# EAGLE design Outside Pool Controller v2 (EAGLE 6.5.0)
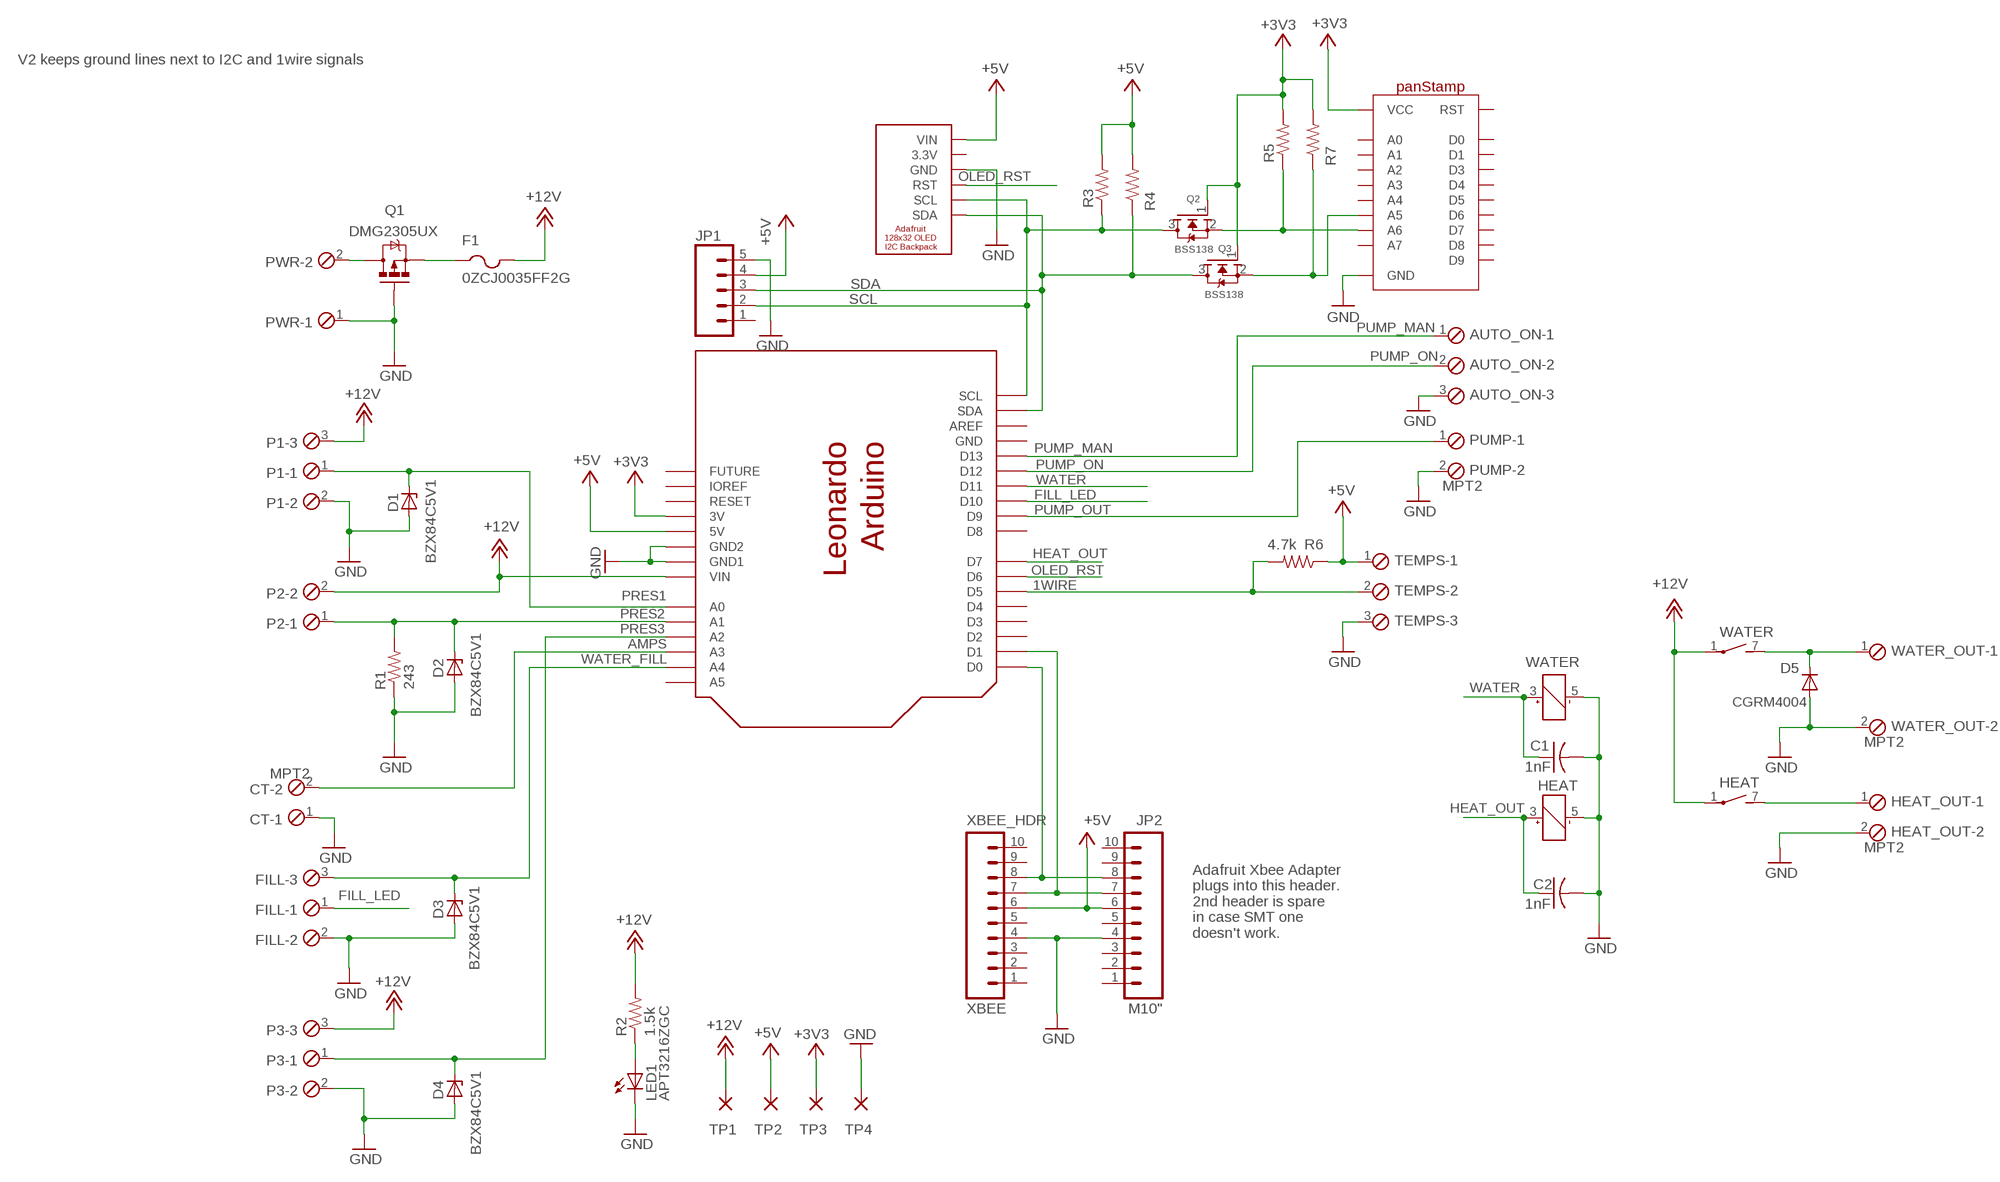
[diagram p0: schematic, sheet 1]

## Parts
AUTO_ON  MPT3  [3POL254]
C1  1nF  C-USC1206  [C1206]
C2  1nF  C-USC1206  [C1206]
CT  MPT2  [2POL254]
D1  BZX84C5V1  ZENER-DIODESOT23  [SOT23]
D2  BZX84C5V1  ZENER-DIODESOT23  [SOT23]
D3  BZX84C5V1  ZENER-DIODESOT23  [SOT23]
D4  BZX84C5V1  ZENER-DIODESOT23  [SOT23]
D5  CGRM4004  DIODE_SOD-123FL  [SOD-123FL]
F1  0ZCJ0035FF2G  PTCFUSE-1206  [R1206]
FILL  MPT3  [3POL254]
HEAT  REED  [REED]
HEAT_OUT  MPT2  [2POL254]
JP1  M05NO_SILK  [1X05_NO_SILK]
JP2  M10"  [1X10]
LED1  APT3216ZGC  LEDCHIPLED_1206  [CHIPLED_1206]
P1  MPT3  [3POL254]
P2  MPT2  [2POL254]
P3  MPT3  [3POL254]
PUMP  MPT2  [2POL254]
PWR  MPT2  [2POL254]
Q1  DMG2305UX  MOSFET-PCHANNELSMD  [SOT23-3]
Q2  BSS138  MOSFET-NREFLOW  [SOT23]
Q3  BSS138  MOSFET-NREFLOW  [SOT23]
R1  243  R-US_M1206  [M1206]
R2  1.5k  R-US_M1206  [M1206]
R3  R-US_M1206  [M1206]
R4  R-US_M1206  [M1206]
R5  R-US_M1206  [M1206]
R6  4.7k  R-US_M1206  [M1206]
R7  R-US_M1206  [M1206]
TEMPS  MPT3  [3POL254]
TP1  2,15/1,0  [2,15/1,0]
TP2  2,15/1,0  [2,15/1,0]
TP3  WIREPAD2,15/1,0  [2,15/1,0]
TP4  WIREPAD2,15/1,0  [2,15/1,0]
U$1  ARDUINO_LEONARDO  [ARDUINO_LEONARDO]
U$2  ADAFRUIT_128X32_OLED  [ADAFRUIT_OLED_128X32]
U$3  PANSTAMPNO_TEXT  [PANSTAMP_NOTEXT]
WATER  REED  [REED]
WATER_OUT  MPT2  [2POL254]
XBEE_HDR  XBEE  M10SMD_MALE  [1X10_SMD_MALE]

## Nets
1WIRE: R6.2 TEMPS.2 U$1.D5
+3V3 [power]: Q2.1(G) Q3.1(G) R5.2 R7.2 TP3.1(P) U$1.3V U$3.VCC
+5V [power]: JP1.4 JP2.6 R3.2 R4.2 R6.1 TEMPS.1 TP2.1(P) U$1.5V U$2.P$6(VIN) XBEE_HDR.6
+12V [power]: F1.2 HEAT.1(2:P) P1.3 P2.2 P3.3 R2.2 TP1.1(P) U$1.VIN WATER.1(2:P)
AMPS: CT.2 U$1.A3
FILL_LED: FILL.1 U$1.D10
GND [power]: AUTO_ON.3 C1.2 C2.2 CT.1 D1.1(A) D2.1(A) D3.1(A) D4.1(A) D5.A FILL.2 HEAT.5(1:-) HEAT_OUT.2 JP1.5 JP2.4 LED1.C P1.2 P3.2 PUMP.2 PWR.1 Q1.1(G) R1.1 TEMPS.3 TP4.1(P) U$1.GND$2(GND2) U$1.GND$3(GND1) U$2.P$4(GND) U$3.GND$1(GND) U$3.GND$7(GND) U$3.GND$15(GND) U$3.GND$23(GND) U$3.GND$24(GND) WATER.5(1:-) WATER_OUT.2 XBEE_HDR.4
HEAT_OUT: C2.1 HEAT.3(1:+) U$1.D7
N$1: D5.C WATER.7(2:S) WATER_OUT.1
N$2: HEAT.7(2:S) HEAT_OUT.1
N$3 [power]: PWR.2 Q1.3(D)
N$4: LED1.A R2.1
N$5 [power]: F1.1 Q1.2(S)
OLED_RST: U$1.D6 U$2.P$3(RST)
PRES1: D1.3(C) P1.1 U$1.A0
PRES2: D2.3(C) P2.1 R1.2 U$1.A1
PRES3: D4.3(C) P3.1 U$1.A2
PUMP_MAN: AUTO_ON.1 U$1.D13
PUMP_ON: AUTO_ON.2 U$1.D12
PUMP_OUT: PUMP.1 U$1.D9
SCL: JP1.2 Q2.3(D) R3.1 U$1.SCL U$2.P$2(SCL)
SCL3.3: Q2.2(S) R5.1 U$3.A6
SDA: JP1.3 Q3.3(D) R4.1 U$1.SDA U$2.P$1(SDA)
SDA3.3: Q3.2(S) R7.1 U$3.A5
WATER: C1.1 U$1.D11 WATER.3(1:+)
WATER_FILL: D3.3(C) FILL.3 U$1.A4
XBEE0: JP2.8 U$1.D0 XBEE_HDR.8
XBEE1: JP2.7 U$1.D1 XBEE_HDR.7
Unconnected: JP1.1 JP2.1 JP2.2 JP2.3 JP2.5 JP2.9 JP2.10 U$1.A5 U$1.AREF U$1.D2 U$1.D3 U$1.D4 U$1.D8 U$1.IOREF U$1.RESERVED(FUTURE) U$1.RESET U$3.A0 U$3.A1 U$3.A2 U$3.A3 U$3.A4 U$3.A7 U$3.D0 U$3.D1 U$3.D3 U$3.D4 U$3.D5 U$3.D6 U$3.D7 U$3.D8 U$3.D9 U$3.RESET(RST) XBEE_HDR.1 XBEE_HDR.2 XBEE_HDR.3 XBEE_HDR.5 XBEE_HDR.9 XBEE_HDR.10

## Notes on the sheet
- V2 keeps ground lines next to I2C and 1wire signals
- Adafruit Xbee Adapter
  plugs into this header.
  2nd header is spare 
  in case SMT one
  doesn't work.

## Power pins joined to a net without a drawn wire
3.3V: U$2.P$5(3.3V)
GND: U$1.GND

## Library data of the parts
AUTO_ON FILL P1 P3 TEMPS = con-phoenix-254:MPT3: Screw Terminal Block 0.1" pitch Pheonix 1725669 TE 282834-3; OC_FARNELL: unknown; OC_NEWARK: unknown
C1 C2 = rcl:C-US: CAPACITOR, American symbol
CT HEAT_OUT P2 PUMP PWR WATER_OUT = con-phoenix-254:MPT2: Screw Terminal Block 0.1" pitch Pheonix 1725656 TE 282834-2; OC_FARNELL: unknown; OC_NEWARK: unknown
D1-D4 = diode:ZENER-DIODE: Z-Diode
D5 = adafruit:DIODE: Diode SMADIODE - SMA Surface Mount Package 20V 1A Schottky Diode Digikey: 641-1014-6-ND DO-1N4148 - Through Hole Small Current Diode SOD-123 20V 1 A (.5mV Vf) Schottky Diode - Digikey: MBRX120TPMSCT-ND SOD-323 10V 570mA (.38mV Vf, 3ns) Schottky Diode - Digikey: ZLLS410CT-ND SOD-523 30V 30mA Schottky Diode (RB751S-40TE61) - Digikey: RB751S-40TE61CT-ND SOT23-R/W - SOT23 Package (R = Solder Paste/Reflow Ovens, W = Hand-Soldering) BAT54Film 40V 300mA - Digikey: 497-7162-1-ND
F1 = adafruit:PTCFUSE: PTC fuses, resettable thermistors
HEAT WATER = relay:REED: RELAY reed, 1 x norm. open with polarity, grid 5.08; OC_FARNELL: unknown; OC_NEWARK: unknown
JP1 = SparkFun-Connectors:M05: Header 5 Standard 5-pin 0.1" header. Use with straight break away headers (SKU : PRT-00116), right angle break away headers (PRT-00553), swiss pins (PRT-00743), machine pins (PRT-00117), and female headers (PRT-00115). Molex polarized connector foot print use with SKU : PRT-08230 with associated crimp pins and housings.
JP2 = SparkFun-Connectors:M10: Header 10 Standard 10-pin 0.1" header. Use with straight break away headers (SKU : PRT-00116), right angle break away headers (PRT-00553), swiss pins (PRT-00743), machine pins (PRT-00117), and female headers (PRT-00115).
LED1 = adafruit:LED: LED OSRAM: - CHIPLED LG R971, LG N971, LY N971, LG Q971, LY Q971, LO R971, LY R971 LH N974, LH R974 LS Q976, LO Q976, LY Q976 LO Q996 - Hyper CHIPLED LW Q18S LB Q993, LB Q99A, LB R99A - SideLED LS A670, LO A670, LY A670, LG A670, LP A670 LB A673, LV A673, LT A673, LW A673 LH A674 LY A675 LS A676, LA A676, LO A676, LY A676, LW A676 LS A679, LY A679, LG A679 - Hyper Micro SIDELED® LS Y876, LA Y876, LO Y876, LY Y876 LT Y87S - SmartLED LW L88C, LW L88S LB L89C, LB L89S, LG L890 LS L89K, LO L89K, LY L89K LS L896, LA L896, LO L896, LY L896 - TOPLED LS T670, LO T670, LY T670, LG T670, LP T670 LSG T670, LSP T670, LSY T670, LOP T670, LYG T670 LG T671, LOG T671, LSG T671 LB T673, LV T673, LT T673, LW T673 LH T674 LS T676, LA T676, LO T676, LY T676, LB T676, LH T676, LSB T676, LW T676 LB T67C, LV T67C, LT T67C, LS T67K, LO T67K, LY T67K, LW E67C LS E67B, LA E67B, LO E67B, LY E67B, LB E67C, LV E67C, LT E67C LW T67C LS T679, LY T679, LG T679 LS T770, LO T770, LY T770, LG T770, LP T770 LB T773, LV T773, LT T773, LW T773 LH T774 LS E675, LA E675, LY E675, LS T675 LS T776, LA T776, LO T776, LY T776, LB T776 LHGB T686 LT T68C, LB T68C - Hyper Mini TOPLED® LB M676 - Mini TOPLED Santana® LG M470 LS M47K, LO M47K, LY M47K Source: http://www.osram.convergy.de/
Q1 = SparkFun-DiscreteSemi:MOSFET-PCHANNEL: Generic PMOSFET IRLML2244 - TRANS-11153 (SOT-23 -20V -4.3A) (1.Gate 2.Source 3.Drain) FQP27P06 - COM-10349 <http://www.sparkfun.com/products/10349> (TO-220 -60V -27A) (1.Gate 2.Source 3.Drain)
Q2 Q3 = adafruit:MOSFET-N: N-Channel Mosfet 2N7002E - 60V 260mA SOT23 [Digikey: 2N7002ET1GOSTR-ND] - REEL BSH103 - 30V 850mA SOT23 [Digikey: 568-5013-1-ND]
R1-R7 = adafruit:R-US_: RESISTOR, American symbol
TP1 TP2 = wirepad:2,15/1,0: THROUGH-HOLE PAD
TP3 TP4 = wirepad:WIREPAD: Wire PAD connect wire on PCB
U$1 = SRG:ARDUINO_LEONARDO: Arduino Leonardo I2C Pins: D2, D3 PWM Pins: D3, D5, D5, D11, D13 Interrup Pint: D2, D3 http://arduino.cc/en/Main/arduinoBoardLeonardo
U$2 = SRG:ADAFRUIT_128X32_OLED: Adafriut 128x32 OLED display with I2C communication http://www.adafruit.com/products/931
U$3 = SRG:PANSTAMP: panStamp panStamps are small wireless modules programmable from the Arduino IDE. Each module contains an Atmega328p MCU and a Texas Instruments CC1101 RF interface, providing the necessary connectivity and processing power to create autonomous low-power wireless motes. Everything contained into a compact DIP-24 module. http://www.panstamp.com Vin: 2.5 to 3.6 volts A4 - SDA A5 - SCL PWM: D3,5,6,9,10,11 Interrupts: D2,3 Connected grounds with command: CONNECT ANY GND 'GND$1 GND$7 GND$15 GND$23 GND$24';
XBEE_HDR = SparkFun-Connectors:M10: Header 10 Standard 10-pin 0.1" header. Use with straight break away headers (SKU : PRT-00116), right angle break away headers (PRT-00553), swiss pins (PRT-00743), machine pins (PRT-00117), and female headers (PRT-00115).; PROD_ID: CONN-11291

## Net classes
0 default: width 0.254 mm, drill 0.254 mm, clearance 0.254 mm
1 power: width 0.406 mm, drill 0.254 mm, clearance 0.254 mm

## Board
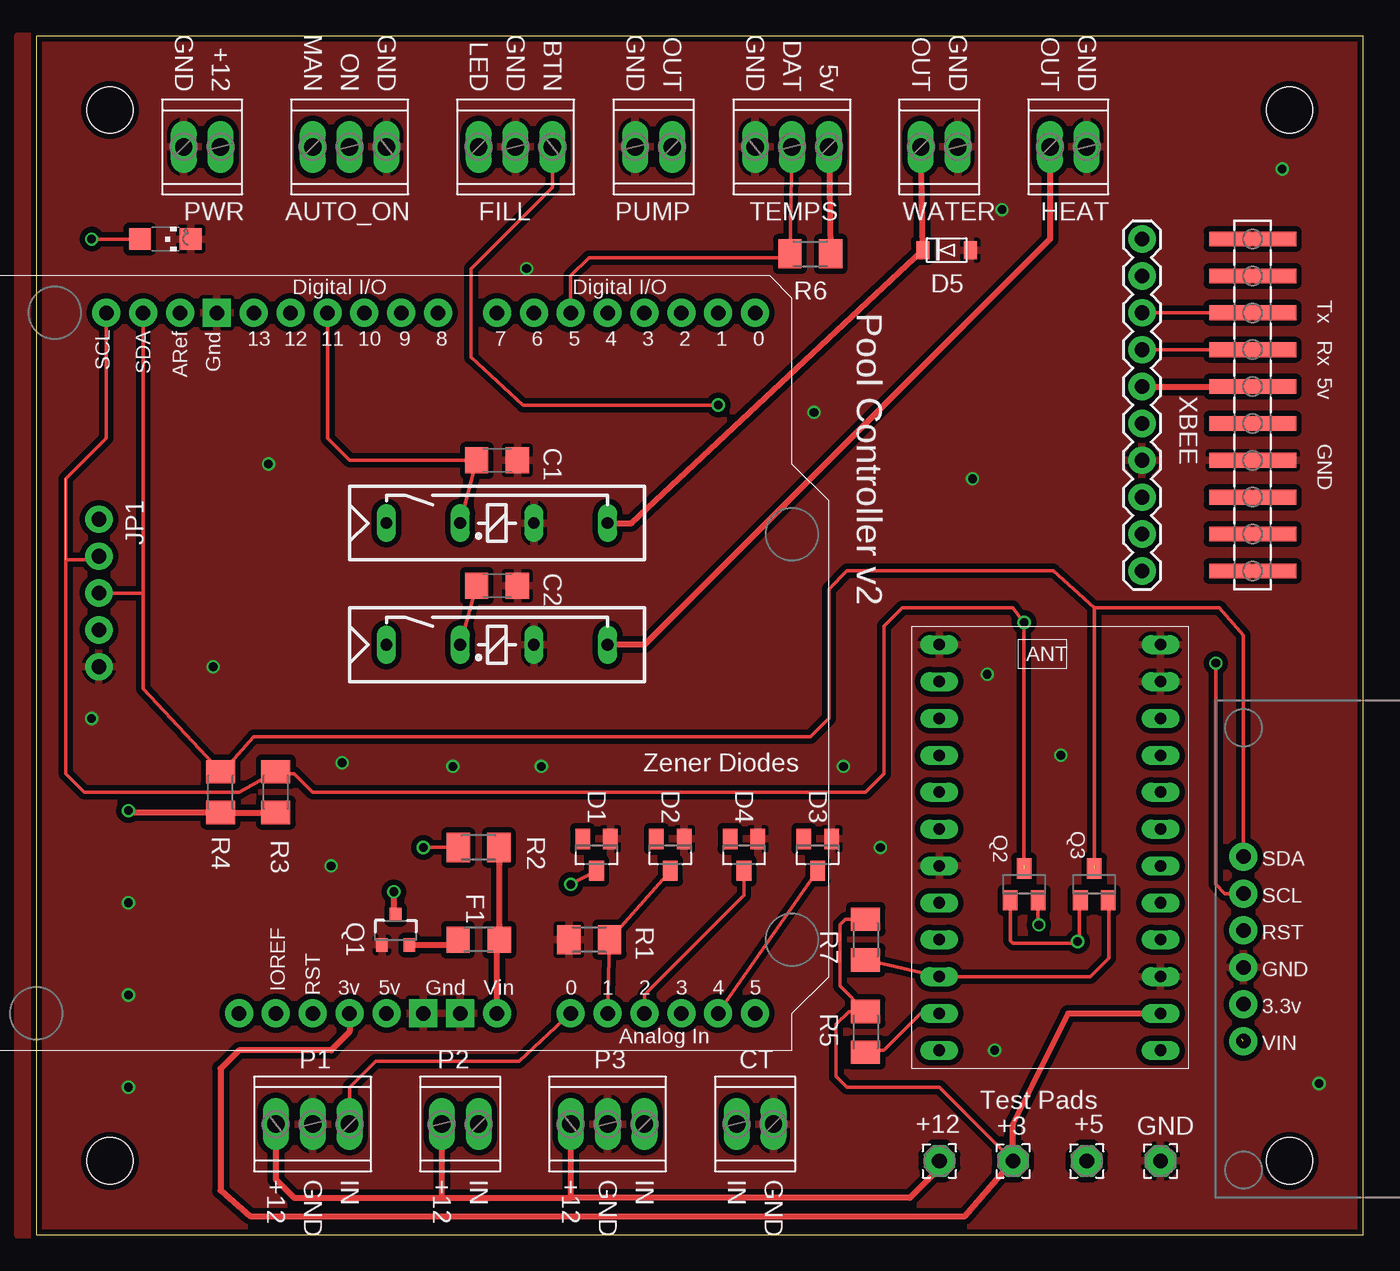
[diagram p1: board, top side]
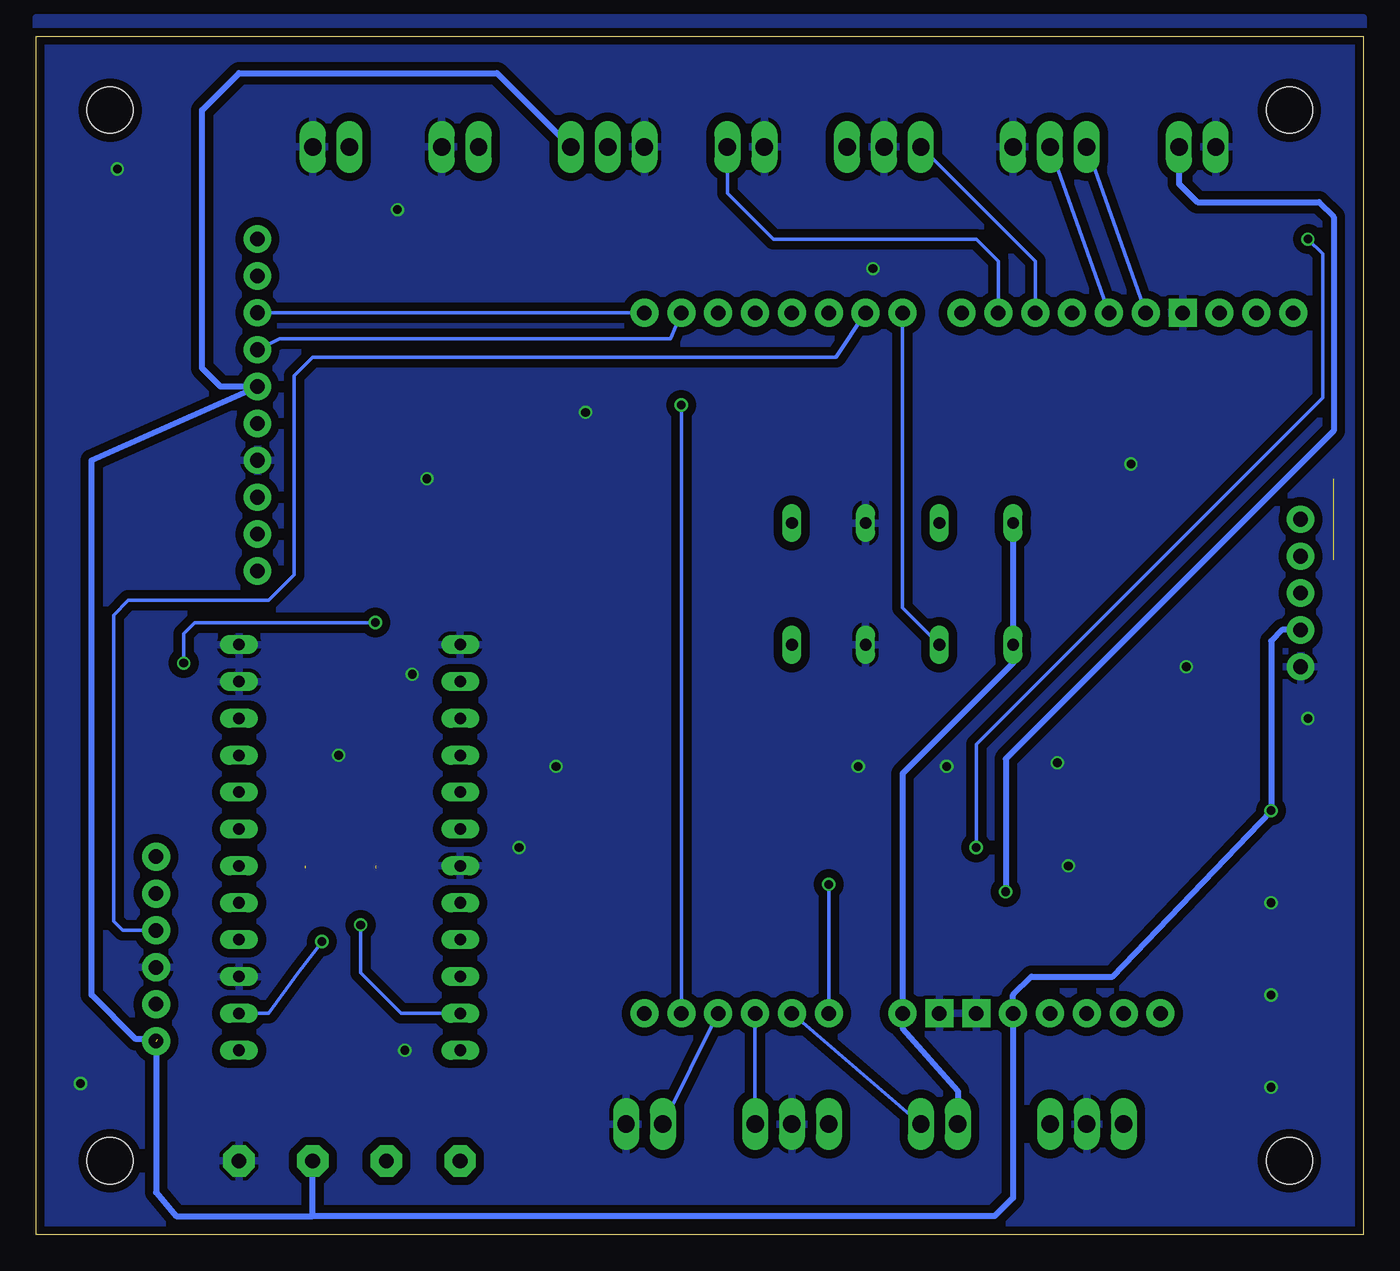
[diagram p2: board, bottom side, seen from below]

Size 91.44 x 82.55 mm. Coordinates in mm from the lower left corner, seen from the top.
Outline: 91.44,0 91.44,82.55 0,82.55 0,0 91.44,0
Copper layers (1*16): Top 0.035mm / dielectric 1.5mm / Bottom 0.035mm
Design rules "ITEADstudio_DRC": minimum track width 6mil, minimum drill 12mil, track to track 6mil, track to pad 6mil, pad to pad 6mil, via to via 6mil, smd to smd 0mil, copper to edge 10mil, drill to drill 10mil, minimum pad ring 10mil, minimum via ring 6mil, stop-mask expansion 2mil, vias tented up to drill 100mil, thermal gap 10mil
Holes 3.2 mm at 5.08,77.47 86.36,77.47 86.36,5.08 5.08,5.08

### Footprints (pad centres in the part's own frame; a part is rotated, then mirrored left to right if it is on the bottom)
3POL254 = drill 1.2 long: 1 -2.54,0; 2 0,0; 3 2.54,0
C1206 = smd 1.6 x 1.8: 1 -1.4,0; 2 1.4,0
2POL254 = drill 1.2 long: 1 -1.27,0; 2 1.27,0
SOT23 = smd 1 x 1.4: 1 -0.95,-1.1; 2 0.95,-1.1; 3 0,1.1
SOD-123FL = smd 0.91 x 1.22: A 1.637,0; C -1.637,0
R1206 = smd 1.6 x 1.803: 1 -1.422,0; 2 1.422,0
REED = drill 0.813 long: 1 -17.78,2.54; 3 -12.7,2.54; 5 -7.62,2.54; 7 -2.54,2.54
1X05_NO_SILK = drill 1.016 pad 1.88: 1 0,0; 2 2.54,0; 3 5.08,0; 4 7.62,0; 5 10.16,0
1X10 = drill 1.016 pad 1.88: 1 0,0; 2 2.54,0; 3 5.08,0; 4 7.62,0; 5 10.16,0; 6 12.7,0; 7 15.24,0; 8 17.78,0; 9 20.32,0; 10 22.86,0
CHIPLED_1206 = smd 1.5 x 1.5: A 0,-1.75; C 0,1.75
SOT23-3 = smd 0.8 x 0.9: 1 -0.95,-1; 2 0.95,-1; 3 0,1.1
M1206 = smd 1.6 x 2: 1 -1.4,0; 2 1.4,0
2,15/1,0 = drill 1.016 pad 2.159 octagon: 1 0,0
ARDUINO_LEONARDO = drill 1 pad 1.93: 3V 1.27,-24.13; 5V 3.81,-24.13; A0 16.51,-24.13; A1 19.05,-24.13; A2 21.59,-24.13; A3 24.13,-24.13; A4 26.67,-24.13; A5 29.21,-24.13; AREF -10.414,24.13; D0 29.21,24.13; D1 26.67,24.13; D2 24.13,24.13; D3 21.59,24.13; D4 19.05,24.13; D5 16.51,24.13; D6 13.97,24.13; D7 11.43,24.13; D8 7.366,24.13; D9 4.826,24.13; D10 2.286,24.13; D11 -0.254,24.13; D12 -2.794,24.13; D13 -5.334,24.13; IOREF -3.81,-24.13; RESERVED -6.35,-24.13; RESET -1.27,-24.13; SCL -15.494,24.13; SDA -12.954,24.13; VIN 11.43,-24.13 | drill 1 pad 1.93 square: GND -7.874,24.13; GND$2 8.89,-24.13; GND$3 6.35,-24.13
ADAFRUIT_OLED_128X32 = drill 1 pad 1.93: P$1 -6.985,-6.985; P$2 -4.445,-6.985; P$3 -1.905,-6.985; P$4 0.635,-6.985; P$5 3.175,-6.985; P$6 5.715,-6.985
PANSTAMP_NOTEXT = drill 0.8 long: A0 -7.62,6.35; A1 -7.62,3.81; A2 -7.62,1.27; A3 -7.62,-3.81; A4 -7.62,-6.35; A5 -7.62,-8.89; A6 -7.62,-11.43; A7 -7.62,-13.97; D0 7.62,-6.35; D1 7.62,-3.81; D3 7.62,-1.27; D4 7.62,1.27; D5 7.62,3.81; D6 7.62,6.35; D7 7.62,8.89; D8 -7.62,11.43; D9 -7.62,8.89; GND$1 -7.62,13.97; GND$7 -7.62,-1.27; GND$15 7.62,-8.89; GND$23 7.62,11.43; GND$24 7.62,13.97; RESET 7.62,-13.97; VCC 7.62,-11.43
1X10_SMD_MALE = smd 1.02 x 6: 1 0,0; 2 2.54,0; 3 5.08,0; 4 7.62,0; 5 10.16,0; 6 12.7,0; 7 15.24,0; 8 17.78,0; 9 20.32,0; 10 22.86,0

### Placement (x,y rotation side)
AUTO_ON  21.59,74.93 0 top
C1  31.75,53.34 0 top
C2  31.75,44.7 0 top
CT  49.53,7.62 180 top
D1  38.61,26.16 180 top
D2  43.69,26.16 180 top
D3  53.85,26.16 180 top
D4  48.77,26.16 180 top
D5  62.74,67.82 0 top
F1  30.48,20.32 0 top
FILL  33.02,74.93 0 top
HEAT  41.91,38.1 0 top
HEAT_OUT  71.12,74.93 0 top
JP1  4.32,49.28 270 top
JP2  76.2,45.72 90 top
LED1  8.89,68.58 270 top
P1  19.05,7.62 180 top
P2  29.21,7.62 180 top
P3  39.37,7.62 180 top
PUMP  42.55,74.93 180 top
PWR  11.43,74.93 0 top
Q1  24.77,20.95 0 top
Q2  68.07,24.13 0 top
Q3  72.9,24.13 0 top
R1  38.1,20.32 0 top
R2  30.48,26.67 0 top
R3  16.51,30.48 270 top
R4  12.7,30.48 270 top
R5  57.15,13.97 90 top
R6  53.34,67.56 180 top
R7  57.15,20.32 90 top
TEMPS  52.07,74.93 180 top
TP1  62.23,5.08 180 top
TP2  72.39,5.08 180 top
TP3  67.31,5.08 180 top
TP4  77.47,5.08 180 top
U$1  20.32,39.37 0 top
U$2  90.17,19.05 270 top
U$3  69.85,26.67 0 top
WATER  41.91,46.48 0 top
WATER_OUT  62.23,74.93 0 top
XBEE_HDR  83.82,45.72 90 top

### Tracks (layer width: path | path; a pad name or v marks a point on that pad's centre or on a via)
1WIRE
  Top 0.254: TEMPS.2 R6.2 51.69,67.31 38.1,67.31 36.83,66.04 U$1.D5
+3V3  (via drill 0.6)
  Top 0.254: R5.2 57.28,15.37 | R7.2 55.76,21.72 55.37,21.34 55.37,17.15 R5.2 | R5.2 56.01,15.37 55.12,14.48 55.12,10.92 55.88,10.16 62.23,10.16 TP3.1 | Q2.1 67.12,20.25 67.31,20.07 71.63,20.07 v71.75,20.19 71.88,20.32 71.88,22.96 Q3.1
  Top 0.406: U$1.3V 21.59,13.97 20.32,12.7 13.97,12.7 12.7,11.43 12.7,3.05 14.73,1.27 64.01,1.27 TP3.1 67.31,7.62 71.12,15.24 U$3.VCC
  Bottom 0.254: U$3.VCC 75.44,15.24 73.41,18.03 v71.75,20.19
+5V  (via drill 0.6)  (1 unrouted)
  Top 0.406: R3.2 R4.2 6.35,29.08 v6.35,29.21 | JP2.6 XBEE_HDR.6 | TEMPS.1 R6.1
  Bottom 0.406: JP1.4 5.59,41.66 6.35,40.89 v6.35,29.21 17.27,17.78 22.86,17.78 24.13,16.51 U$1.5V | 24.13,14.73 U$1.5V | U$2.P$6 83.19,2.92 81.79,1.27 72.39,1.27 | 72.39,1.27 TP2.1 | 83.06,13.46 84.58,13.46 87.63,16.51 87.63,53.34 JP2.6 78.74,58.42 80.01,59.69 80.01,77.47 77.47,80.01 59.69,80.01 TEMPS.1 | U$1.5V 24.13,2.54 25.4,1.27 72.39,1.27
+12V
  Top 0.406: P1.3 16.51,3.81 17.78,2.54 27.94,2.54 | 27.94,2.54 36.83,2.54 | P2.2 27.94,2.54 | U$1.VIN 31.75,20.17 F1.2 31.88,20.34 R2.2 | P3.3 36.83,2.54 | TP1.1 62.23,4.57 60.2,2.54 36.83,2.54
  Bottom 0.406: P2.2 27.94,9.91 31.75,14.22 U$1.VIN 31.75,31.75 24.13,39.37 HEAT.1 WATER.1
AMPS
  Bottom 0.254: U$1.A3 CT.2
FILL_LED
  Bottom 0.254: U$1.D10 22.61,67.06 FILL.1
GND  (via drill 0.6)
  other vias: 3.81,35.56 20.32,25.4 34.8,32.26 28.7,32.26 55.63,32.26 21.08,32.51 12.19,39.12 6.35,22.86 6.35,16.51 6.35,10.16 16,53.09 33.78,66.55 53.59,56.64 64.52,52.07 85.85,73.41 66.55,70.61 70.61,33.02 58.17,26.67 88.39,10.41 65.53,38.61 66.04,12.7
  pour Top (isolate 0.381, rank 6): -1.27,82.55 91.44,82.55 91.44,0 -1.27,0
  pour Bottom (isolate 0.572, rank 6): 91.44,0 0,0 0,83.82 91.44,83.82
HEAT_OUT
  Top 0.254: HEAT.3 C2.1
  Bottom 0.254: HEAT.3 31.75,43.18 U$1.D7
N$1
  Top 0.406: WATER.7 41.03,49.02 D5.C WATER_OUT.1
N$2
  Top 0.406: HEAT_OUT.1 69.85,68.58 41.91,40.64 HEAT.7
N$3  (via drill 0.6)
  Top 0.406: 24.72,22.1 Q1.3 24.64,22.18 v24.64,23.62
  Bottom 0.406: PWR.2 12.7,72.39 11.43,71.12 3.05,71.12 2.03,70.1 2.03,55.37 24.64,32.77 v24.64,23.62
N$4  (via drill 0.6)
  Top 0.254: R2.1 v26.67,26.67 | v3.81,68.58 LED1.A
  Bottom 0.254: v26.67,26.67 26.67,33.78 2.79,57.66 2.79,67.56 v3.81,68.58
N$5
  Top 0.406: Q1.2 29.06,19.95 F1.1
OLED_RST
  Bottom 0.254: U$1.D6 36.32,60.45 72.39,60.45 73.66,59.18 73.66,45.47 75.44,43.69 85.09,43.69 86.11,42.67 86.11,21.59 85.47,20.95 U$2.P$3
PRES1  (via drill 0.6)
  Top 0.254: v36.83,24.13 D1.3 | P1.1 21.59,10.16 23.37,11.94 33.27,11.94 U$1.A0
  Bottom 0.254: U$1.A0 v36.83,24.13
PRES2
  Top 0.254: D2.3 R1.2 U$1.A1
  Bottom 0.254: P2.1 U$1.A1
PRES3
  Top 0.254: D4.3 48.77,23.37 41.91,16.51 U$1.A2
  Bottom 0.254: U$1.A2 P3.1
PUMP_MAN
  Bottom 0.254: U$1.D13 AUTO_ON.1
PUMP_ON
  Bottom 0.254: U$1.D12 AUTO_ON.2
PUMP_OUT
  Bottom 0.254: U$1.D9 25.15,67.06 26.67,68.58 40.64,68.58 43.81,71.75 PUMP.1
SCL  (via drill 0.6)  (2 unrouted)
  Top 0.254: 2.03,46.48 3.81,46.48 JP1.2 | 68.07,25.4 v68.07,42.16 67.31,43.18 59.69,43.18 58.42,41.91 58.42,31.75 57.15,30.48 19.05,30.48 17.78,31.75 16.64,31.75 R3.1 13.97,30.48 3.3,30.48 2.03,31.75 2.03,52.07 4.83,54.86 U$1.SCL | U$2.P$2 81.92,23.5 81.28,24.13 v81.28,39.37
  Bottom 0.254: v81.28,39.37 81.28,41.4 80.52,42.16 v68.07,42.16
SCL3.3  (via drill 0.6)
  Top 0.254: U$3.A6 60.96,15.24 58.42,12.7 57.28,12.7 R5.1 | Q2.2 69.02,21.4 v69.09,21.34
  Bottom 0.254: v69.09,21.34 69.09,18.03 66.29,15.24 U$3.A6
SDA  (1 unrouted)
  Top 0.254: U$1.SDA 7.37,44.2 | 7.37,44.2 JP1.3 | 7.37,44.2 7.37,37.59 R4.1 12.83,31.88 14.99,34.29 53.34,34.29 54.61,35.56 54.61,44.45 55.88,45.72 70.1,45.72 72.9,43.18 | 72.9,25.4 72.9,43.18 | U$2.P$1 83.19,41.27 81.53,43.18 72.9,43.18
SDA3.3
  Top 0.254: R7.1 U$3.A5 72.64,17.78 73.91,19.05 73.91,22.96 Q3.2
WATER
  Top 0.254: U$1.D11 20.07,54.86 21.59,53.34 C1.1 WATER.3
WATER_FILL  (via drill 0.6)
  Top 0.254: FILL.3 35.56,72.14 29.97,66.55 29.97,60.45 33.53,57.15 v46.99,57.15 | U$1.A4 D3.3
  Bottom 0.254: U$1.A4 v46.99,57.15
XBEE0
  Top 0.254: JP2.8 XBEE_HDR.8
  Bottom 0.254: U$1.D0 JP2.8
XBEE1
  Top 0.254: JP2.7 XBEE_HDR.7
  Bottom 0.254: JP2.7 74.68,61.72 47.75,61.72 U$1.D1

### Text on the board
tPlace: GND | +12 | MAN | ON | GND | LED | GND | BTN | GND | OUT | GND | DAT | 5v | OUT | GND | OUT | GND | WATER | HEAT | Pool Controller v2 | Tx | Rx | 5v | XBEE | GND | Zener Diodes | Test Pads | +12 | +3 | +5 | GND | +12 | GND | IN | +12 | IN | +12 | GND | IN | IN | GND